# EAGLE design nw2s-b2dsp-panel (EAGLE 7.6.0)
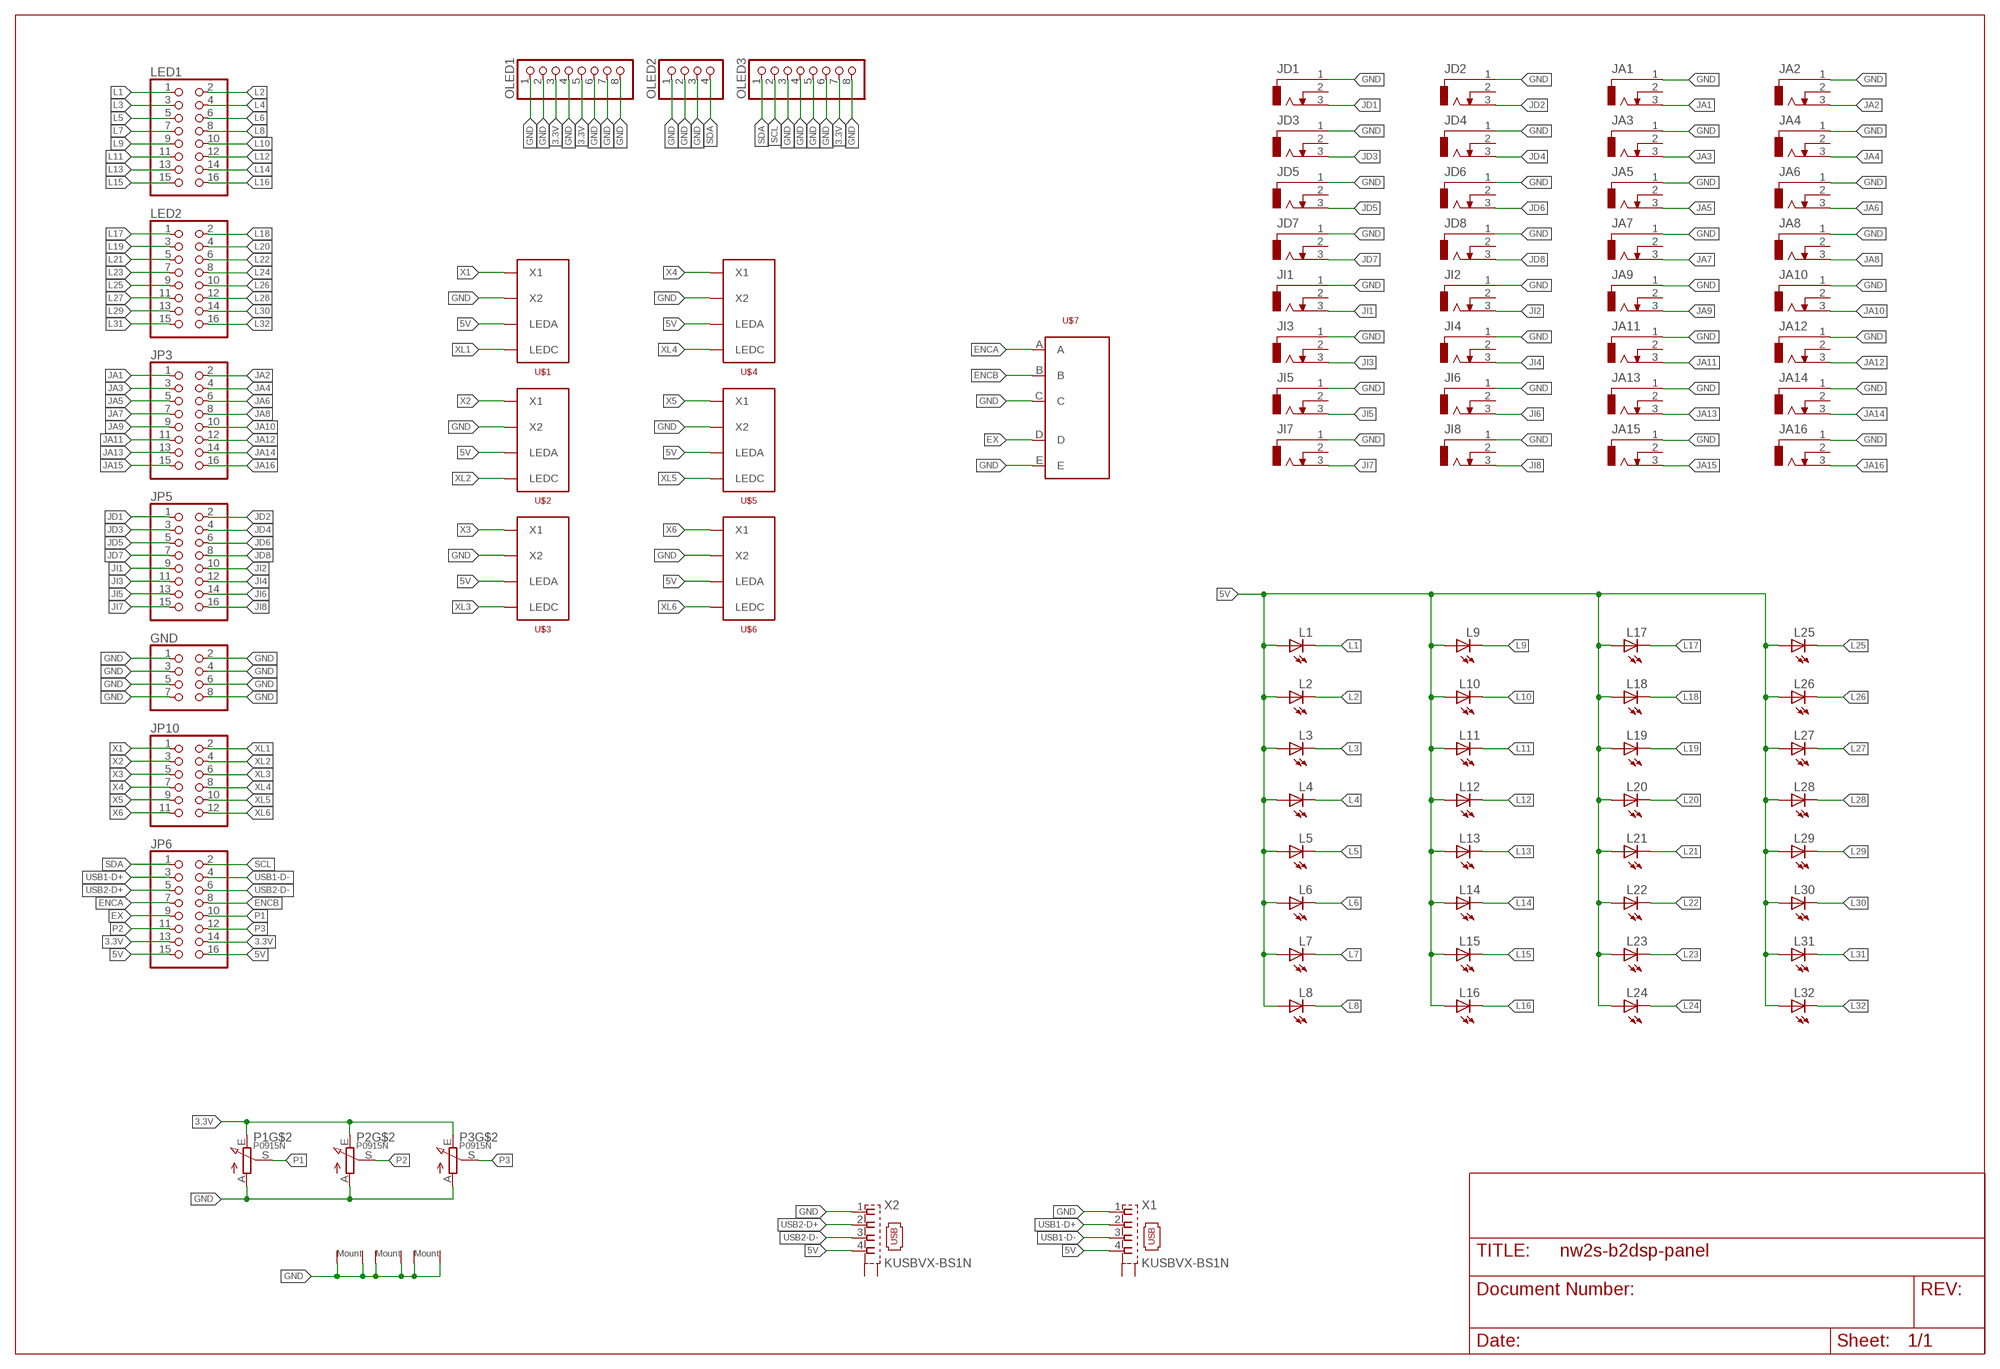
[diagram p0: schematic, sheet 1]

## Parts
GND  PINHD-2X4  [2X04]
JA1  THONK35A2  [THONK35A-2]
JA2  THONK35A2  [THONK35A-2]
JA3  THONK35A2  [THONK35A-2]
JA4  THONK35A2  [THONK35A-2]
JA5  THONK35A2  [THONK35A-2]
JA6  THONK35A2  [THONK35A-2]
JA7  THONK35A2  [THONK35A-2]
JA8  THONK35A2  [THONK35A-2]
JA9  THONK35A2  [THONK35A-2]
JA10  THONK35A2  [THONK35A-2]
JA11  THONK35A2  [THONK35A-2]
JA12  THONK35A2  [THONK35A-2]
JA13  THONK35A2  [THONK35A-2]
JA14  THONK35A2  [THONK35A-2]
JA15  THONK35A2  [THONK35A-2]
JA16  THONK35A2  [THONK35A-2]
JD1  THONK35A2  [THONK35A-2]
JD2  THONK35A2  [THONK35A-2]
JD3  THONK35A2  [THONK35A-2]
JD4  THONK35A2  [THONK35A-2]
JD5  THONK35A2  [THONK35A-2]
JD6  THONK35A2  [THONK35A-2]
JD7  THONK35A2  [THONK35A-2]
JD8  THONK35A2  [THONK35A-2]
JI1  THONK35A2  [THONK35A-2]
JI2  THONK35A2  [THONK35A-2]
JI3  THONK35A2  [THONK35A-2]
JI4  THONK35A2  [THONK35A-2]
JI5  THONK35A2  [THONK35A-2]
JI6  THONK35A2  [THONK35A-2]
JI7  THONK35A2  [THONK35A-2]
JI8  THONK35A2  [THONK35A-2]
JP3  PINHD-2X8  [2X08]
JP5  PINHD-2X8  [2X08]
JP6  PINHD-2X8  [2X08]
JP10  PINHD-2X6  [2X06]
L1  LED3MM  [LED3MM]
L2  LED3MM  [LED3MM]
L3  LED3MM  [LED3MM]
L4  LED3MM  [LED3MM]
L5  LED3MM  [LED3MM]
L6  LED3MM  [LED3MM]
L7  LED3MM  [LED3MM]
L8  LED3MM  [LED3MM]
L9  LED3MM  [LED3MM]
L10  LED3MM  [LED3MM]
L11  LED3MM  [LED3MM]
L12  LED3MM  [LED3MM]
L13  LED3MM  [LED3MM]
L14  LED3MM  [LED3MM]
L15  LED3MM  [LED3MM]
L16  LED3MM  [LED3MM]
L17  LED3MM  [LED3MM]
L18  LED3MM  [LED3MM]
L19  LED3MM  [LED3MM]
L20  LED3MM  [LED3MM]
L21  LED3MM  [LED3MM]
L22  LED3MM  [LED3MM]
L23  LED3MM  [LED3MM]
L24  LED3MM  [LED3MM]
L25  LED3MM  [LED3MM]
L26  LED3MM  [LED3MM]
L27  LED3MM  [LED3MM]
L28  LED3MM  [LED3MM]
L29  LED3MM  [LED3MM]
L30  LED3MM  [LED3MM]
L31  LED3MM  [LED3MM]
L32  LED3MM  [LED3MM]
LED1  PINHD-2X8  [2X08]
LED2  PINHD-2X8  [2X08]
OLED1  PINHD-1X8  [1X08]
OLED2  PINHD-1X4  [1X04]
OLED3  PINHD-1X8  [1X08]
P1  P0915N  [P0915N]
P2  P0915N  [P0915N]
P3  P0915N  [P0915N]
U$1  MEC5G  [MEC5G]
U$2  MEC5G  [MEC5G]
U$3  MEC5G  [MEC5G]
U$4  MEC5G  [MEC5G]
U$5  MEC5G  [MEC5G]
U$6  MEC5G  [MEC5G]
U$7  EN11X  [EN11]
X1  KUSBVX-BS1N  [KUSBVX-BS1N]
X2  KUSBVX-BS1N  [KUSBVX-BS1N]

## Nets
3.3V: JP6.13 JP6.14 OLED1.3 OLED1.5 OLED3.7 P1.E P2.E P3.E
5V: JP6.15 JP6.16 L1.A L2.A L3.A L4.A L5.A L6.A L7.A L8.A L9.A L10.A L11.A L12.A L13.A L14.A L15.A L16.A L17.A L18.A L19.A L20.A L21.A L22.A L23.A L24.A L25.A L26.A L27.A L28.A L29.A L30.A L31.A L32.A U$1.P$4(LEDA) U$2.P$4(LEDA) U$3.P$4(LEDA) U$4.P$4(LEDA) U$5.P$4(LEDA) U$6.P$4(LEDA) X1.4 X2.4
ENCA: JP6.7 U$7.A
ENCB: JP6.8 U$7.B
EX: JP6.9 U$7.D
GND: GND.1 GND.2 GND.3 GND.4 GND.5 GND.6 GND.7 GND.8 JA1.1 JA2.1 JA3.1 JA4.1 JA5.1 JA6.1 JA7.1 JA8.1 JA9.1 JA10.1 JA11.1 JA12.1 JA13.1 JA14.1 JA15.1 JA16.1 JD1.1 JD2.1 JD3.1 JD4.1 JD5.1 JD6.1 JD7.1 JD8.1 JI1.1 JI2.1 JI3.1 JI4.1 JI5.1 JI6.1 JI7.1 JI8.1 OLED1.1 OLED1.2 OLED1.4 OLED1.6 OLED1.7 OLED1.8 OLED2.1 OLED2.2 OLED2.3 OLED3.3 OLED3.4 OLED3.5 OLED3.6 OLED3.8 P1.A P1.GND@1(GND) P1.GND@2(GND) P2.A P2.GND@1(GND) P2.GND@2(GND) P3.A P3.GND@1(GND) P3.GND@2(GND) U$1.P$3(X2) U$2.P$3(X2) U$3.P$3(X2) U$4.P$3(X2) U$5.P$3(X2) U$6.P$3(X2) U$7.C U$7.E X1.1 X2.1
JA1: JA1.3 JP3.1
JA2: JA2.3 JP3.2
JA3: JA3.3 JP3.3
JA4: JA4.3 JP3.4
JA5: JA5.3 JP3.5
JA6: JA6.3 JP3.6
JA7: JA7.3 JP3.7
JA8: JA8.3 JP3.8
JA9: JA9.3 JP3.9
JA10: JA10.3 JP3.10
JA11: JA11.3 JP3.11
JA12: JA12.3 JP3.12
JA13: JA13.3 JP3.13
JA14: JA14.3 JP3.14
JA15: JA15.3 JP3.15
JA16: JA16.3 JP3.16
JD1: JD1.3 JP5.1
JD2: JD2.3 JP5.2
JD3: JD3.3 JP5.3
JD4: JD4.3 JP5.4
JD5: JD5.3 JP5.5
JD6: JD6.3 JP5.6
JD7: JD7.3 JP5.7
JD8: JD8.3 JP5.8
JI1: JI1.3 JP5.9
JI2: JI2.3 JP5.10
JI3: JI3.3 JP5.11
JI4: JI4.3 JP5.12
JI5: JI5.3 JP5.13
JI6: JI6.3 JP5.14
JI7: JI7.3 JP5.15
JI8: JI8.3 JP5.16
L1: L1.K(C) LED1.1
L2: L2.K(C) LED1.2
L3: L3.K(C) LED1.3
L4: L4.K(C) LED1.4
L5: L5.K(C) LED1.5
L6: L6.K(C) LED1.6
L7: L7.K(C) LED1.7
L8: L8.K(C) LED1.8
L9: L9.K(C) LED1.9
L10: L10.K(C) LED1.10
L11: L11.K(C) LED1.11
L12: L12.K(C) LED1.12
L13: L13.K(C) LED1.13
L14: L14.K(C) LED1.14
L15: L15.K(C) LED1.15
L16: L16.K(C) LED1.16
L17: L17.K(C) LED2.1
L18: L18.K(C) LED2.2
L19: L19.K(C) LED2.3
L20: L20.K(C) LED2.4
L21: L21.K(C) LED2.5
L22: L22.K(C) LED2.6
L23: L23.K(C) LED2.7
L24: L24.K(C) LED2.8
L25: L25.K(C) LED2.9
L26: L26.K(C) LED2.10
L27: L27.K(C) LED2.11
L28: L28.K(C) LED2.12
L29: L29.K(C) LED2.13
L30: L30.K(C) LED2.14
L31: L31.K(C) LED2.15
L32: L32.K(C) LED2.16
P1: JP6.10 P1.S
P2: JP6.11 P2.S
P3: JP6.12 P3.S
SCL: JP6.2 OLED3.2
SDA: JP6.1 OLED2.4 OLED3.1
USB1-D+: JP6.3 X1.2
USB1-D-: JP6.4 X1.3
USB2-D+: JP6.5 X2.2
USB2-D-: JP6.6 X2.3
X1: JP10.1 U$1.P$2(X1)
X2: JP10.3 U$2.P$2(X1)
X3: JP10.5 U$3.P$2(X1)
X4: JP10.7 U$4.P$2(X1)
X5: JP10.9 U$5.P$2(X1)
X6: JP10.11 U$6.P$2(X1)
XL1: JP10.2 U$1.P$1(LEDC)
XL2: JP10.4 U$2.P$1(LEDC)
XL3: JP10.6 U$3.P$1(LEDC)
XL4: JP10.8 U$4.P$1(LEDC)
XL5: JP10.10 U$5.P$1(LEDC)
XL6: JP10.12 U$6.P$1(LEDC)
Unconnected: JA1.2 JA2.2 JA3.2 JA4.2 JA5.2 JA6.2 JA7.2 JA8.2 JA9.2 JA10.2 JA11.2 JA12.2 JA13.2 JA14.2 JA15.2 JA16.2 JD1.2 JD2.2 JD3.2 JD4.2 JD5.2 JD6.2 JD7.2 JD8.2 JI1.2 JI2.2 JI3.2 JI4.2 JI5.2 JI6.2 JI7.2 JI8.2 X1.M1(S1) X1.M2(S2) X2.M1(S1) X2.M2(S2)

## Library data of the parts
GND = pinhead:PINHD-2X4: PIN HEADER
JA1-JA16 JD1-JD8 JI1-JI8 = nw2s:THONK35A: Thonkiconn 3.5mm Switching Jack by nw2s.net for thonk.co.uk
JP3 JP5 JP6 LED1 LED2 = pinhead:PINHD-2X8: PIN HEADER
JP10 = pinhead:PINHD-2X6: PIN HEADER
L1-L32 = nw2s:LED: LED OSRAM: - CHIPLED LG R971, LG N971, LY N971, LG Q971, LY Q971, LO R971, LY R971 LH N974, LH R974 LS Q976, LO Q976, LY Q976 LO Q996 - Hyper CHIPLED LW Q18S LB Q993, LB Q99A, LB R99A - SideLED LS A670, LO A670, LY A670, LG A670, LP A670 LB A673, LV A673, LT A673, LW A673 LH A674 LY A675 LS A676, LA A676, LO A676, LY A676, LW A676 LS A679, LY A679, LG A679 - Hyper Micro SIDELED® LS Y876, LA Y876, LO Y876, LY Y876 LT Y87S - SmartLED LW L88C, LW L88S LB L89C, LB L89S, LG L890 LS L89K, LO L89K, LY L89K LS L896, LA L896, LO L896, LY L896 - TOPLED LS T670, LO T670, LY T670, LG T670, LP T670 LSG T670, LSP T670, LSY T670, LOP T670, LYG T670 LG T671, LOG T671, LSG T671 LB T673, LV T673, LT T673, LW T673 LH T674 LS T676, LA T676, LO T676, LY T676, LB T676, LH T676, LSB T676, LW T676 LB T67C, LV T67C, LT T67C, LS T67K, LO T67K, LY T67K, LW E67C LS E67B, LA E67B, LO E67B, LY E67B, LB E67C, LV E67C, LT E67C LW T67C LS T679, LY T679, LG T679 LS T770, LO T770, LY T770, LG T770, LP T770 LB T773, LV T773, LT T773, LW T773 LH T774 LS E675, LA E675, LY E675, LS T675 LS T776, LA T776, LO T776, LY T776, LB T776 LHGB T686 LT T68C, LB T68C - Hyper Mini TOPLED® LB M676 - Mini TOPLED Santana® LG M470 LS M47K, LO M47K, LY M47K Source: http://www.osram.convergy.de LUXEON: - LUMILED® LXK2-PW12-R00, LXK2-PW12-S00, LXK2-PW14-U00, LXK2-PW14-V00 LXK2-PM12-R00, LXK2-PM12-S00, LXK2-PM14-U00 LXK2-PE12-Q00, LXK2-PE12-R00, LXK2-PE12-S00, LXK2-PE14-T00, LXK2-PE14-U00 LXK2-PB12-K00, LXK2-PB12-L00, LXK2-PB12-M00, LXK2-PB14-N00, LXK2-PB14-P00, LXK2-PB14-Q00 LXK2-PR12-L00, LXK2-PR12-M00, LXK2-PR14-Q00, LXK2-PR14-R00 LXK2-PD12-Q00, LXK2-PD12-R00, LXK2-PD12-S00 LXK2-PH12-R00, LXK2-PH12-S00 LXK2-PL12-P00, LXK2-PL12-Q00, LXK2-PL12-R00 Source: www.luxeon.com KINGBRIGHT: KA-3528ASYC Source: www.kingbright.com
OLED1 OLED3 = nw2s:PINHD-1X8: PIN HEADER
OLED2 = nw2s:PINHD-1X4: PIN HEADER
P1-P3 = pot-tt_electronics:P0915N
U$1-U$6 = nw2s:MEC5G
U$7 = nw2s:EN11X
X1 X2 = con-kycon:KUSBVX-BS1N: USB B-type Receptacle Vertical, 4 Position, Through Hole Source: Sibalco Kycon KUSBVX-BS1N-xxx.pdf

## Board
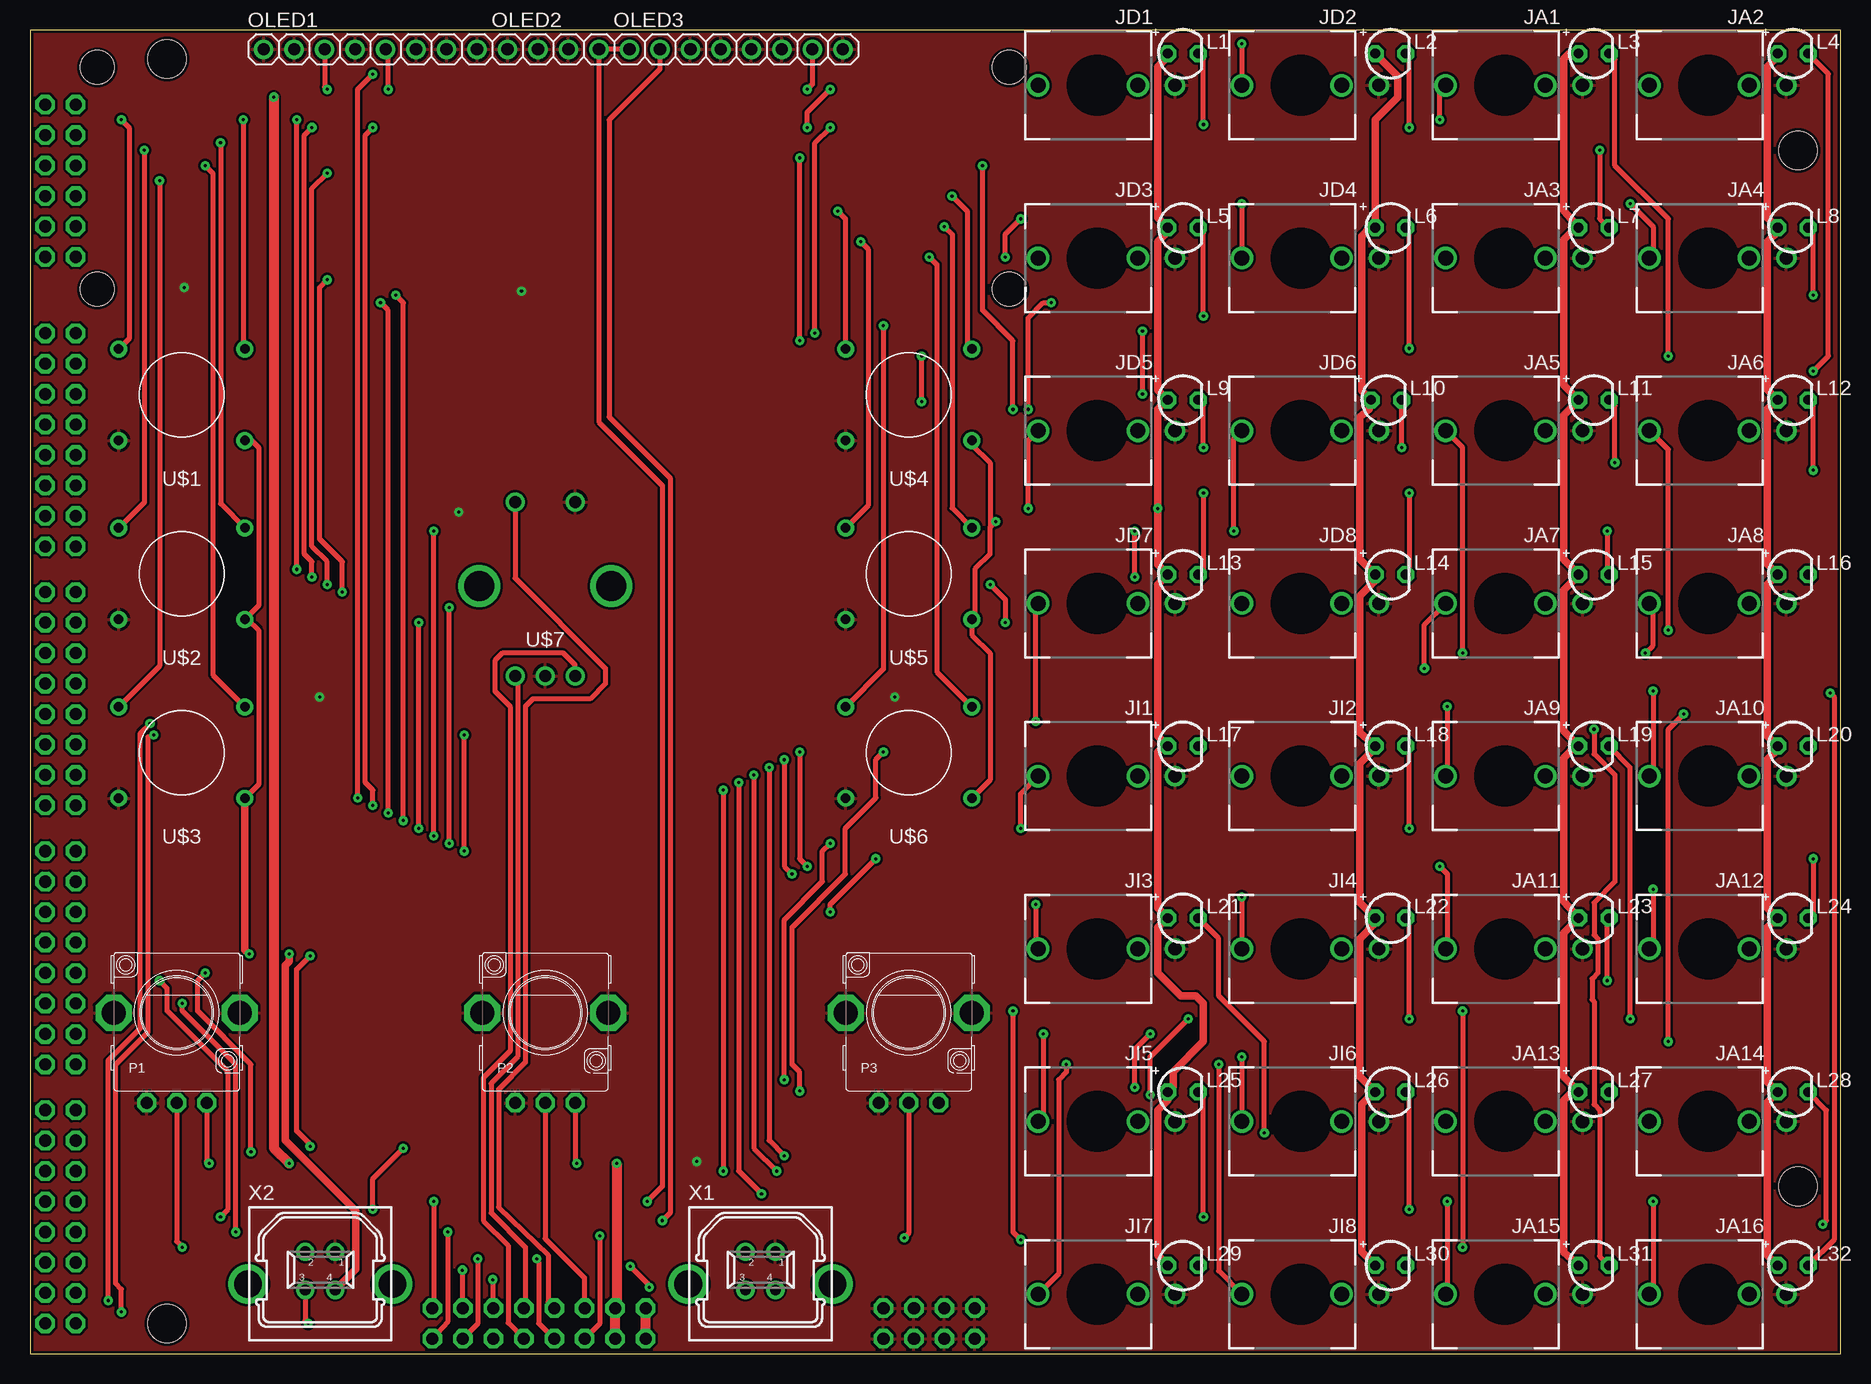
[diagram p1: board, top side]
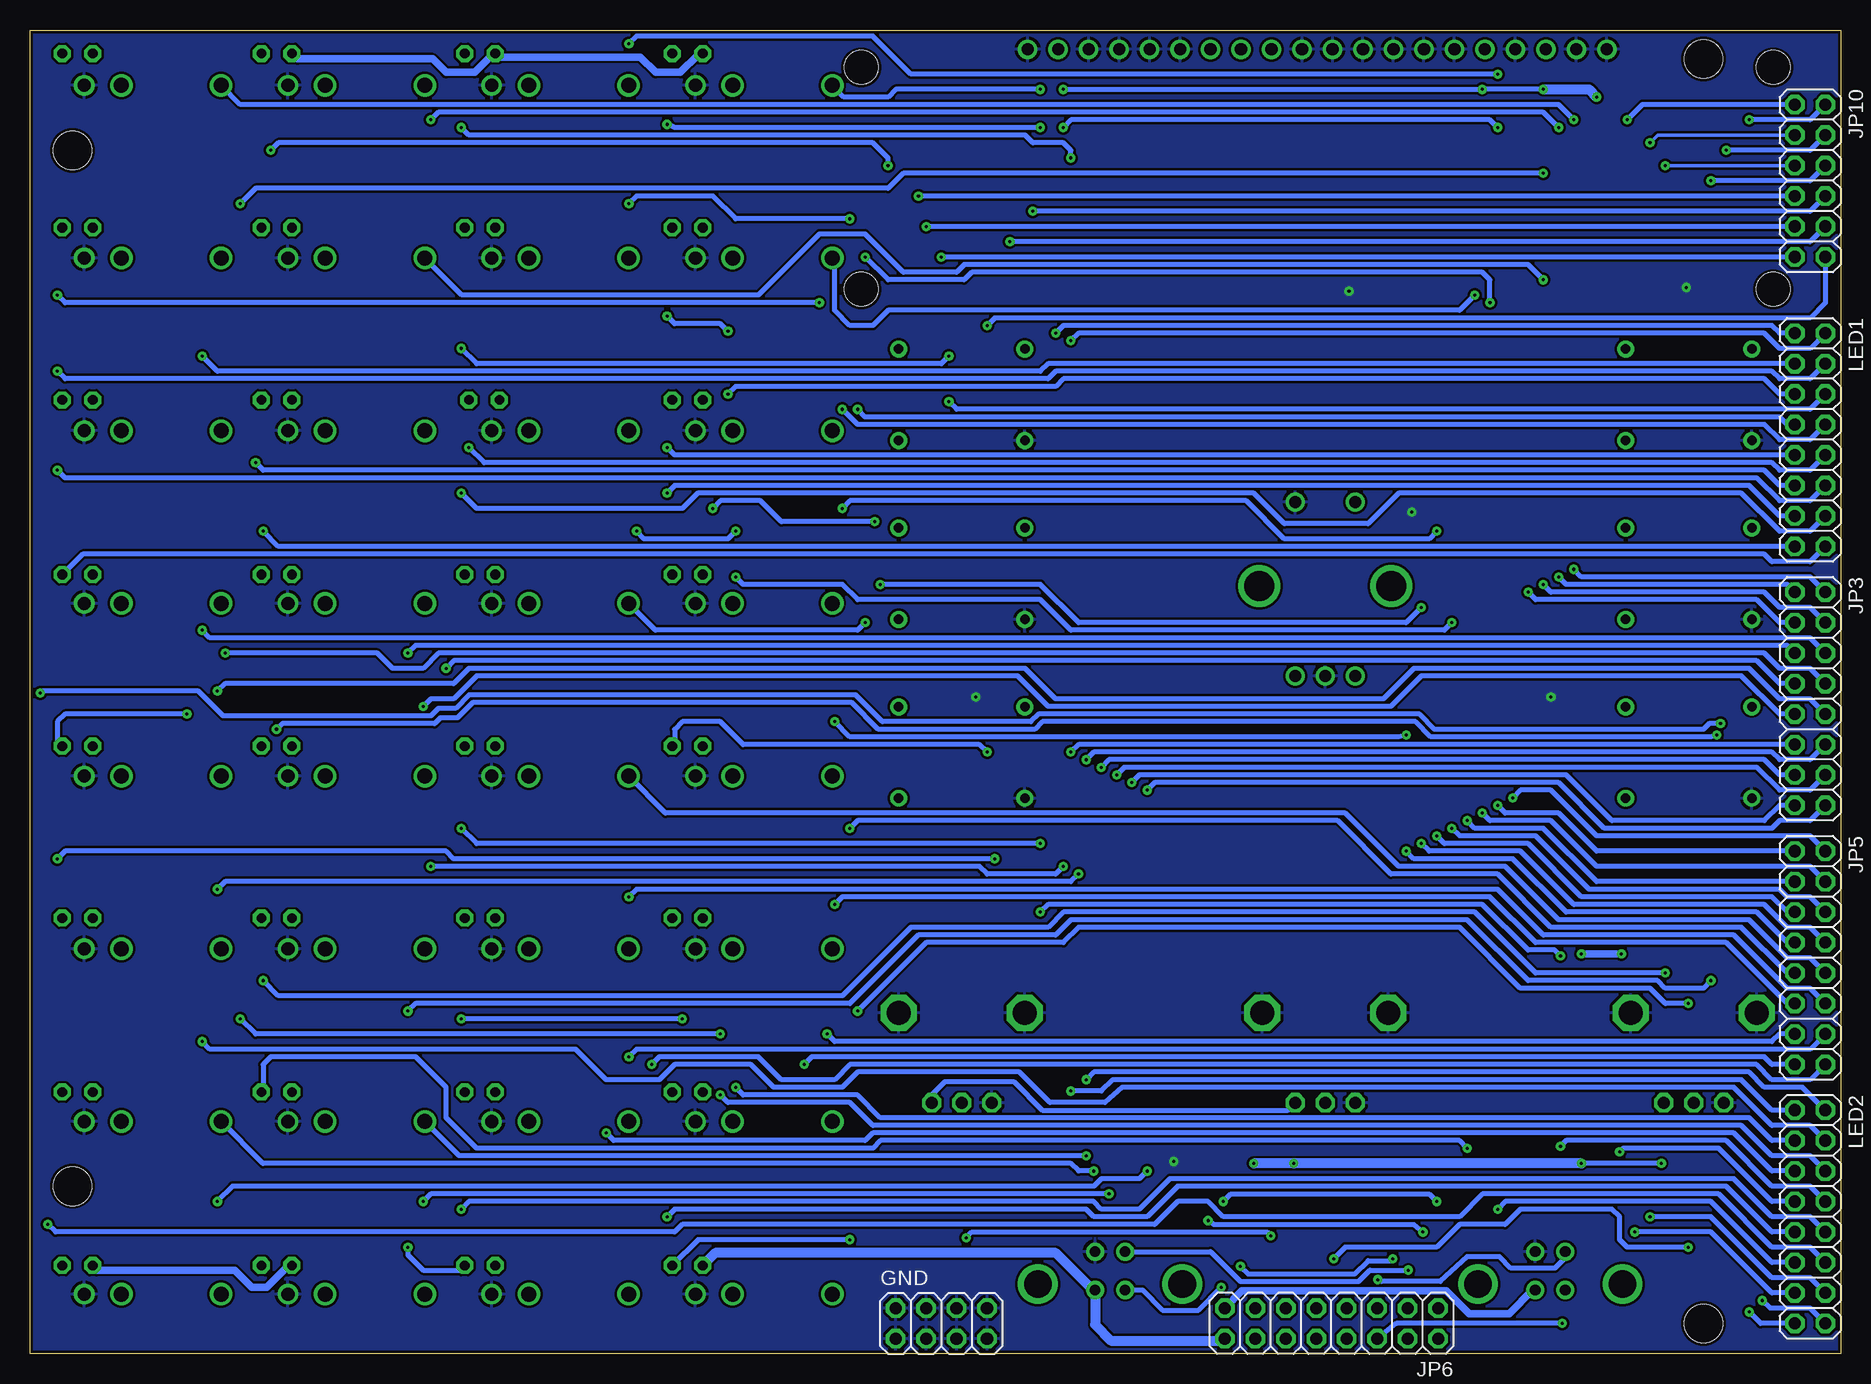
[diagram p2: board, bottom side, seen from below]

Size 150.88 x 110.36 mm. Coordinates in mm from the lower left corner, seen from the top.
Outline: 0,0 150.88,0 150.88,110.36 0,110.36 0,0
Copper layers (1*16): Top 0.035mm / dielectric 1.5mm / Bottom 0.035mm
Design rules "SparkFun *": minimum track width 8mil, minimum drill 10mil, track to track 8mil, track to pad 8mil, pad to pad 8mil, via to via 8mil, smd to smd 8mil, copper to edge 10mil, drill to drill 8mil, minimum pad ring 12mil, minimum via ring 10mil, stop-mask expansion 4mil, vias tented up to drill 25mil, thermal gap 10mil
Holes 2.8 mm at 5.6,107.25 5.6,88.75 81.6,107.25 81.6,88.75
Holes 3.2 mm at 11.43,107.95 11.43,2.54 147.32,13.97 147.32,100.33

### Footprints (pad centres in the part's own frame; a part is rotated, then mirrored left to right if it is on the bottom)
2X04 = drill 1.016 octagon: 1 -3.81,-1.27; 2 -3.81,1.27; 3 -1.27,-1.27; 4 -1.27,1.27; 5 1.27,-1.27; 6 1.27,1.27; 7 3.81,-1.27; 8 3.81,1.27
THONK35A-2 = drill 1.1 pad 1.5: 1 0,-6.48 | drill 1.25 pad 1.65: 2 0,-3.38; 3 0,4.92
2X08 = drill 1.016 octagon: 1 -8.89,-1.27; 2 -8.89,1.27; 3 -6.35,-1.27; 4 -6.35,1.27; 5 -3.81,-1.27; 6 -3.81,1.27; 7 -1.27,-1.27; 8 -1.27,1.27; 9 1.27,-1.27; 10 1.27,1.27; 11 3.81,-1.27; 12 3.81,1.27; 13 6.35,-1.27; 14 6.35,1.27; 15 8.89,-1.27; 16 8.89,1.27
2X06 = drill 1.016 octagon: 1 -6.35,-1.27; 2 -6.35,1.27; 3 -3.81,-1.27; 4 -3.81,1.27; 5 -1.27,-1.27; 6 -1.27,1.27; 7 1.27,-1.27; 8 1.27,1.27; 9 3.81,-1.27; 10 3.81,1.27; 11 6.35,-1.27; 12 6.35,1.27
LED3MM = drill 0.813 octagon: A -1.27,0; K 1.27,0
1X08 = drill 1.016: 1 -8.89,0; 2 -6.35,0; 3 -3.81,0; 4 -1.27,0; 5 1.27,0; 6 3.81,0; 7 6.35,0; 8 8.89,0
1X04 = drill 1.016: 1 -3.81,0; 2 -1.27,0; 3 1.27,0; 4 3.81,0
P0915N = drill 1 pad 1.6 octagon: A -2.5,-7.5; E 2.5,-7.5; S 0,-7.5 | drill 2 pad 3 octagon: GND@1 -5.25,0; GND@2 5.25,0
MEC5G = drill 0.8: P$1 -5.258,3.81; P$2 5.258,3.81; P$3 -5.258,-3.81; P$4 5.258,-3.81
EN11 = drill 1: A -2.5,-7.5; B 2.5,-7.5; C 0,-7.5; D -2.5,7; E 2.5,7 | drill 2.499: MNT1 5.5,0; MNT2 -5.5,0
KUSBVX-BS1N = drill 0.9 pad 1.422: 1 1.25,2.7; 2 -1.25,2.7; 3 -1.25,-0.5; 4 1.25,-0.5 | drill 2.3 pad 2.7: M1 -6.02,0; M2 6.02,0

### Placement (x,y rotation side)
GND  74.93,2.54 0 bottom
JA1  122.9,105.75 90 top
JA2  139.88,105.75 90 top
JA3  122.9,91.35 90 top
JA4  139.88,91.35 90 top
JA5  122.9,76.96 90 top
JA6  139.88,76.96 90 top
JA7  122.9,62.56 90 top
JA8  139.88,62.56 90 top
JA9  122.9,48.16 90 top
JA10  139.88,48.16 90 top
JA11  122.9,33.77 90 top
JA12  139.88,33.77 90 top
JA13  122.9,19.37 90 top
JA14  139.88,19.37 90 top
JA15  122.9,4.97 90 top
JA16  139.88,4.97 90 top
JD1  88.94,105.75 90 top
JD2  105.92,105.75 90 top
JD3  88.94,91.35 90 top
JD4  105.92,91.35 90 top
JD5  88.94,76.96 90 top
JD6  105.92,76.96 90 top
JD7  88.94,62.56 90 top
JD8  105.92,62.56 90 top
JI1  88.94,48.16 90 top
JI2  105.92,48.16 90 top
JI3  88.94,33.77 90 top
JI4  105.92,33.77 90 top
JI5  88.94,19.37 90 top
JI6  105.92,19.37 90 top
JI7  88.94,4.97 90 top
JI8  105.92,4.97 90 top
JP3  2.54,54.61 270 bottom
JP5  2.54,33.02 270 bottom
JP6  42.42,2.54 180 bottom
JP10  2.54,97.79 270 bottom
L1  96.08,108.39 0 top
L2  113.38,108.39 0 top
L3  130.32,108.39 0 top
L4  146.91,108.39 0 top
L5  96.08,93.87 0 top
L6  113.38,93.87 0 top
L7  130.32,93.87 0 top
L8  146.91,93.87 0 top
L9  96.08,79.52 0 top
L10  113.03,79.52 0 top
L11  130.32,79.52 0 top
L12  146.91,79.52 0 top
L13  96.08,64.96 0 top
L14  113.38,64.96 0 top
L15  130.32,64.96 0 top
L16  146.91,64.96 0 top
L17  96.08,50.66 0 top
L18  113.38,50.66 0 top
L19  130.32,50.66 0 top
L20  146.91,50.66 0 top
L21  96.08,36.32 0 top
L22  113.38,36.32 0 top
L23  130.32,36.32 0 top
L24  146.91,36.32 0 top
L25  96.08,21.83 0 top
L26  113.38,21.83 0 top
L27  130.32,21.83 0 top
L28  146.91,21.83 0 top
L29  96.08,7.37 0 top
L30  113.38,7.37 0 top
L31  130.32,7.37 0 top
L32  146.91,7.37 0 top
LED1  2.54,76.2 270 bottom
LED2  2.54,11.43 270 bottom
OLED1  28.36,108.75 0 top
OLED2  43.6,108.75 0 top
OLED3  58.84,108.75 0 top
P1  12.23,28.44 0 top
P2  42.94,28.44 0 top
P3  73.23,28.44 0 top
U$1  12.65,79.96 0 top
U$2  12.65,65.04 0 top
U$3  12.65,50.13 0 top
U$4  73.23,79.96 0 top
U$5  73.23,65.04 0 top
U$6  73.23,50.13 0 top
U$7  42.94,64.02 0 top
X1  60.87,5.82 0 top
X2  24.18,5.82 0 top

### Tracks (layer width: path | path; a pad name or v marks a point on that pad's centre or on a via)
3.3V  (via drill 0.25)
  Top 0.406: OLED1.3 24.55,105.62 v24.77,105.41 | v29.84,105.41 29.84,108.54 OLED1.5 | OLED3.7 65.19,105.83 v64.77,105.41 | P2.E 45.44,16 v45.56,15.88 | P1.E 14.72,16.07 v14.92,15.88
  Top 0.813: v20.32,104.78 20.32,17.14 v21.59,15.88 | v48.9,15.88 48.9,3.94 JP6.13 JP6.14
  Bottom 0.406: v24.77,105.41 v29.84,105.41 v64.77,105.41 | P3.E 75.73,21.59 74.61,22.7 68.9,22.7 66.52,20.32 46.05,20.32 P2.E | v14.92,15.88 v21.59,15.88
  Bottom 0.813: v24.77,105.41 20.95,105.41 v20.32,104.78 | v21.59,15.88 v45.56,15.88 v48.9,15.88
5V  (via drill 0.25)
  Top 0.406: U$1.P$4 18.47,76.15 19.05,75.56 19.05,62.38 U$2.P$4 18.14,61.23 19.05,60.33 19.05,47.47 U$3.P$4 | L8.A 145.64,93.57 | L12.A 145.56,79.53 | L16.A 145.61,64.96 | L20.A 145.64,50.39 | L24.A 145.54,36.33 | L28.A 145.64,21.82 | L7.A 128.8,93.87 | L11.A | L15.A 129.05,64.91 | L19.A 128.76,50.66 | L23.A 129.03,36.33 | L27.A 128.51,21.83 | U$4.P$4 78.49,75.82 80.01,74.3 80.01,68.9 | U$6.P$4 80.01,47.84 80.01,58.42 78.49,59.94 U$5.P$4 78.74,61.49 78.74,65.41 80.01,66.67 80.01,68.9 | L18.A 112.11,50.52 | L26.A 112,21.83 | L6.A 111.65,93.87 | L5.A 94.81,93.54 | L9.A 94.77,79.53 | L13.A | L17.A 94.47,50.66 | L21.A 94.75,36.33 | 80.01,68.9 v80.49,69.37
  Top 0.61: L4.A 145.64,108.18 144.78,107.31 144.78,94.73 L8.A | 145.64,93.57 144.78,92.71 144.78,80.39 L12.A | 145.56,79.53 144.78,78.74 144.78,65.82 L16.A | 145.61,64.96 144.78,64.14 144.78,51.52 L20.A | 145.64,50.39 144.78,49.53 144.78,37.19 L24.A | 145.54,36.33 144.78,35.56 144.78,22.69 L28.A | 145.64,21.82 144.78,20.95 144.78,8.23 L32.A | L3.A 128.24,108.39 127.79,107.95 127.79,95.29 L7.A | 128.8,93.87 127.79,92.87 127.79,80.78 L11.A | L11.A 127.79,78.26 127.79,66.21 L15.A | 129.05,64.91 127.79,63.66 127.79,51.91 L19.A | 128.76,50.66 127.79,49.69 127.79,37.74 L23.A | 129.03,36.33 127.79,35.08 127.79,23.09 L27.A | 128.51,21.83 127.79,21.11 127.79,8.46 L31.A | L18.A 110.81,51.8 110.81,63.18 112.11,64.49 L14.A 110.81,66.26 110.81,78.11 111.6,78.74 L10.A 110.97,80.32 110.97,93.19 111.65,93.87 | 112.11,50.52 110.81,49.21 110.81,37.63 L22.A 112.11,35.91 110.81,34.61 110.81,23.13 L26.A | 112,21.83 110.97,20.8 110.97,8.51 L30.A | L1.A 94.81,108.15 93.98,107.31 93.98,94.71 L5.A | 94.81,93.54 93.98,92.71 93.98,80.36 L9.A | 94.77,79.53 93.98,78.74 v93.98,70.48 93.98,65.79 L13.A | L13.A 93.98,64.14 93.98,51.49 L17.A | 94.47,50.66 93.98,50.16 93.98,37.16 L21.A | 94.75,36.33 93.98,35.56 93.98,31.75 95.89,29.84 97.16,29.84 97.79,29.21 97.79,26.04 95.25,23.5 95.25,22.27 L25.A 94.81,21.15 93.98,20.32 93.98,8.2 L29.A | U$3.P$4 17.9,33.69 v18.26,33.34 | v21.59,33.34 21.59,32.7 21.27,32.38 21.27,17.78 27.15,11.91 27.15,7.04 X2.4 | L6.A 112.11,102.9 113.98,104.78 113.98,106.52 L2.A
  Top 0.813: JP6.16 JP6.15
  Bottom 0.406: X2.4 25.63,5.32 | v80.49,69.37 88.27,69.37 90.01,71.12 93.34,71.12 v93.98,70.48 | 95.25,108.27 94.94,108.27 L1.A
  Bottom 0.61: 25.63,5.32 27.62,3.33 30.96,3.33 32.86,5.24 49.88,5.24 JP6.15 | v18.26,33.34 v21.59,33.34 | L3.A 128.6,107.95 117.32,107.95 116.2,106.84 113.82,106.84 112.27,108.39 L2.A 111.83,108.11 100.01,108.11 98.74,106.84 96.68,106.84 95.25,108.27 | L31.A 129.31,7.37 131.13,5.56 132.4,5.56 133.83,6.99 145.26,6.99 L32.A
  Bottom 0.813: JP6.16 51.47,1.11 60.8,1.11 62.12,2.43 X1.4 62.31,5.32 65.41,8.41 93.77,8.41 L29.A
ENCA
  Top 0.406: U$7.A 40.44,56.08 40.64,55.88 40.64,24.77 38.42,22.54 38.42,11.75 41.27,8.89 41.27,3.94 JP6.7
ENCB
  Top 0.406: U$7.B 45.44,57.43 44.45,58.42 39.37,58.42 38.73,57.78 38.73,55.24 40.01,53.98 40.01,25.24 37.78,23.02 37.78,11.11 39.85,9.05 39.85,2.57 JP6.8
EX
  Top 0.406: U$7.D 40.44,64.66 47.94,57.15 47.94,55.88 46.67,54.61 41.91,54.61 41.27,53.98 41.27,24.29 39.05,22.07 39.05,12.22 43.18,8.26 43.18,4.32 JP6.9
GND  (via drill 0.25)
  other vias: 35.72,70.17 24.13,54.77 55.56,16.03 72.07,54.77 40.96,88.58 12.86,88.9
  pour Bottom: 0,110.49 151.13,110.49 151.13,0 0,0
  pour Top: -0.64,111.12 151.76,111.12 151.76,-0.64 -0.64,-0.64
JA1  (via drill 0.25)
  Top 0.406: v23.5,64.77 23.5,66.04 22.86,66.67 22.86,101.6 v23.5,102.23 | v117.47,102.87 117.47,105.25 JA1.3
  Bottom 0.406: JP3.1 4.45,64.14 22.86,64.14 v23.5,64.77 | v23.5,102.23 24.77,103.5 116.84,103.5 v117.47,102.87
JA2  (via drill 0.25)
  Top 0.406: v22.23,65.41 v22.23,102.87
  Bottom 0.406: JP3.2 2.54,64.77 21.59,64.77 v22.23,65.41 | v22.23,102.87 23.5,104.14 133.34,104.14 JA2.3
JA3  (via drill 0.25)
  Top 0.406: v26.04,63.5 26.04,66.04 24.13,67.94 24.13,88.9 v24.77,89.53
  Bottom 0.406: JP3.3 5.08,60.96 6.99,62.87 25.4,62.87 v26.04,63.5 | v24.77,89.53 26.04,90.81 73.03,90.81 73.66,90.17 78.11,90.17 81.28,93.34 85.09,93.34 90.17,88.27 114.89,88.27 JA3.3
JA4  (via drill 0.25)
  Top 0.406: v24.77,64.14 24.77,66.04 23.5,67.31 23.5,97.16 v24.77,98.42 | v133.35,95.89 135.25,93.98 135.25,91.65 JA4.3
  Bottom 0.406: JP3.4 2.54,62.23 5.08,62.23 6.35,63.5 24.13,63.5 v24.77,64.14 | v24.77,98.42 78.11,98.42 79.38,97.16 132.08,97.16 v133.35,95.89
JA5  (via drill 0.25)
  Top 0.406: v119.38,58.42 119.38,75.56 JA5.3
  Bottom 0.406: JP3.5 4.45,59.05 118.75,59.05 v119.38,58.42
JA6  (via drill 0.25)
  Top 0.406: v136.53,60.33 136.53,75.39 JA6.3
  Bottom 0.406: JP3.6 2.54,59.69 135.89,59.69 v136.53,60.33
JA7  (via drill 0.25)
  Top 0.406: v116.2,57.15 116.2,60.79 JA7.3
  Bottom 0.406: JP3.7 5.08,55.88 6.99,57.78 115.57,57.78 v116.2,57.15
JA8  (via drill 0.25)
  Top 0.406: v134.62,58.42 135.25,59.05 135.25,62.26 JA8.3
  Bottom 0.406: JP3.8 2.54,57.15 5.08,57.15 6.35,58.42 116.84,58.42 118.11,57.15 120.65,57.15 121.92,58.42 v134.62,58.42
JA9  (via drill 0.25)
  Top 0.406: v118.11,53.98 118.11,48.3 JA9.3
  Bottom 0.406: JP3.9 5.08,53.34 8.26,56.52 34.92,56.52 37.47,53.98 66.04,53.98 68.58,56.52 113.67,56.52 115.57,54.61 117.47,54.61 v118.11,53.98
JA10  (via drill 0.25)
  Top 0.406: v135.25,55.24 135.25,48.46 JA10.3
  Bottom 0.406: JP3.10 2.54,54.61 5.08,54.61 7.62,57.15 35.56,57.15 38.1,54.61 65.41,54.61 67.94,57.15 114.3,57.15 115.57,55.88 134.62,55.88 v135.25,55.24
JA11  (via drill 0.25)
  Top 0.406: v64.14,50.16 64.14,41.27 v64.77,40.64 | v117.47,40.64 118.11,40.01 118.11,33.9 JA11.3
  Bottom 0.406: JP3.11 63.5,50.8 v64.14,50.16 | v64.77,40.64 65.41,40.01 71.12,40.01 71.75,40.64 v117.47,40.64
JA12  (via drill 0.25)
  Top 0.406: v62.87,49.53 62.87,40.64 v63.5,40.01 | v135.25,38.73 135.25,34.07 JA12.3
  Bottom 0.406: JP3.12 2.54,49.53 5.08,49.53 5.71,50.16 62.23,50.16 v62.87,49.53 | v63.5,40.01 64.14,39.37 134.62,39.37 v135.25,38.73
JA13  (via drill 0.25)
  Top 0.406: v61.59,48.9 61.59,17.78 v62.87,16.51
  Bottom 0.406: JP3.13 5.08,48.26 6.35,49.53 60.96,49.53 v61.59,48.9 | v62.87,16.51 115.12,16.51 JA13.3
JA14  (via drill 0.25)
  Top 0.406: v60.33,48.26 60.33,17.14 v62.23,15.24
  Bottom 0.406: JP3.14 2.54,46.99 5.08,46.99 6.99,48.9 59.69,48.9 v60.33,48.26 | v62.23,15.24 63.5,15.24 64.14,15.88 131.46,15.88 JA14.3
JA15  (via drill 0.25)
  Top 0.406: v59.05,47.62 59.05,15.24 v60.96,13.34 | v118.11,12.7 118.11,5.11 JA15.3
  Bottom 0.406: JP3.15 5.08,45.72 6.35,44.45 19.05,44.45 22.86,48.26 58.42,48.26 v59.05,47.62 | v60.96,13.34 117.47,13.34 v118.11,12.7
JA16  (via drill 0.25)
  Top 0.406: v57.78,46.99 v57.78,15.24 | v135.25,12.7 135.25,5.27 JA16.3
  Bottom 0.406: JP3.16 2.54,44.45 5.08,44.45 5.71,43.81 19.68,43.81 23.5,47.62 57.15,47.62 v57.78,46.99 | v57.78,15.24 58.42,14.61 61.59,14.61 62.23,13.97 133.99,13.97 v135.25,12.7
JD1  (via drill 0.25)
  Top 0.406: v28.57,45.72 28.57,46.99 27.94,47.62 27.94,101.6 v28.57,102.23 | v64.77,102.23 64.77,103.5 v66.67,105.41
  Bottom 0.406: JP5.1 20.32,41.91 23.5,45.09 27.94,45.09 v28.57,45.72 | v28.57,102.23 29.21,102.87 64.14,102.87 v64.77,102.23 | v66.67,105.41 78.74,105.41 79.38,104.78 83.05,104.78 JD1.3
JD2  (via drill 0.25)
  Top 0.406: v27.3,46.35 27.3,105.41 v28.57,106.68 | v100.97,109.22 100.97,105.78 JD2.3
  Bottom 0.406: JP5.2 2.54,43.18 20.32,43.18 24.13,46.99 26.67,46.99 v27.3,46.35 | v28.57,106.68 77.47,106.68 80.64,109.86 100.33,109.86 v100.97,109.22
JD3  (via drill 0.25)
  Top 0.406: v31.11,44.45 31.11,87.63 v30.48,88.27
  Bottom 0.406: JP5.3 20.32,39.37 24.77,43.81 30.48,43.81 v31.11,44.45 | v30.48,88.27 31.75,87 79.38,87 80.64,85.72 82.55,85.72 83.82,87 83.82,91.15 JD3.3
JD4  (via drill 0.25)
  Top 0.406: v29.84,45.09 29.84,87 v29.21,87.63 | v81.28,91.44 81.28,93.34 v82.55,94.61 | v100.97,95.89 100.97,91.39 JD4.3
  Bottom 0.406: JP5.4 2.54,40.64 20.32,40.64 24.13,44.45 29.21,44.45 v29.84,45.09 | v29.21,87.63 29.21,89.53 29.84,90.17 72.39,90.17 73.03,89.53 79.38,89.53 v81.28,91.44 | v82.55,94.61 92.08,94.61 93.98,96.52 100.33,96.52 v100.97,95.89
JD5  (via drill 0.25)
  Top 0.406: v33.66,43.18 v33.66,68.58 | v83.19,70.48 83.19,76.12 JD5.3
  Bottom 0.406: JP5.5 4.45,36.83 5.71,38.1 21.59,38.1 26.04,42.55 33.02,42.55 v33.66,43.18 | v33.66,68.58 34.29,67.94 46.35,67.94 49.53,71.12 82.55,71.12 v83.19,70.48
JD6  (via drill 0.25)
  Top 0.406: v32.38,43.81 v32.38,60.96 | v92.08,64.77 v92.08,68.58 | v100.33,68.58 100.33,76.29 JD6.3
  Bottom 0.406: JP5.6 2.54,38.1 4.45,38.1 5.08,38.73 20.95,38.73 25.4,43.18 31.75,43.18 v32.38,43.81 | v32.38,60.96 33.02,60.33 64.14,60.33 66.67,62.87 81.92,62.87 83.19,64.14 91.44,64.14 v92.08,64.77 | v92.08,68.58 92.71,67.94 99.69,67.94 v100.33,68.58
JD7  (via drill 0.25)
  Top 0.406: v36.2,41.91 v36.2,51.59 | v83.82,52.7 83.82,62.36 JD7.3
  Bottom 0.406: JP5.7 4.45,34.29 6.99,36.83 22.86,36.83 27.3,41.27 35.56,41.27 v36.2,41.91 | v36.2,51.59 36.83,51.44 82.55,51.44 v83.82,52.7
JD8  (via drill 0.25)
  Top 0.406: v34.92,42.55 v34.92,62.23 | v80.01,64.14 81.28,62.87 v81.28,60.96
  Bottom 0.406: JP5.8 2.54,35.56 4.45,35.56 6.35,37.47 22.23,37.47 26.67,41.91 34.29,41.91 v34.92,42.55 | v34.92,62.23 36.2,60.96 63.5,60.96 66.67,64.14 v80.01,64.14 | v81.28,60.96 81.92,60.33 98.76,60.33 JD8.3
JI1  (via drill 0.25)
  Top 0.406: v82.55,43.81 82.55,46.69 JI1.3
  Bottom 0.406: JP5.9 4.45,31.75 8.26,35.56 24.13,35.56 28.57,40.01 37.47,40.01 41.91,44.45 81.92,44.45 v82.55,43.81
JI2
  Bottom 0.406: JP5.10 2.54,33.02 4.45,33.02 7.62,36.2 23.5,36.2 27.94,40.64 36.83,40.64 41.27,45.09 97.92,45.09 JI2.3
JI3  (via drill 0.25)
  Top 0.406: v83.82,37.47 83.82,33.97 JI3.3
  Bottom 0.406: JP5.11 4.45,29.21 9.53,34.29 25.4,34.29 29.21,38.1 83.19,38.1 v83.82,37.47
JI4  (via drill 0.25)
  Top 0.406: v100.97,38.1 100.97,33.8 JI4.3
  Bottom 0.406: JP5.12 2.54,30.48 4.45,30.48 8.89,34.92 24.77,34.92 28.57,38.73 100.33,38.73 v100.97,38.1
JI5  (via drill 0.25)
  Top 0.406: v84.45,26.67 84.45,19.8 JI5.3
  Bottom 0.406: JP5.13 5.08,26.67 5.71,26.04 83.82,26.04 v84.45,26.67
JI6  (via drill 0.25)
  Top 0.406: v100.97,24.77 100.97,19.4 JI6.3
  Bottom 0.406: JP5.14 2.54,25.4 100.33,25.4 v100.97,24.77
JI7  (via drill 0.25)
  Top 0.406: v86.36,24.13 86.36,23.5 85.72,22.86 85.72,6.68 JI7.3
  Bottom 0.406: JP5.15 5.71,24.13 6.35,24.77 85.72,24.77 v86.36,24.13
JI8  (via drill 0.25)
  Top 0.406: v99.06,24.13 99.06,6.91 JI8.3
  Bottom 0.406: JP5.16 2.54,22.86 5.71,22.86 6.99,24.13 82.55,24.13 83.82,22.86 88.27,22.86 90.17,24.77 98.42,24.77 v99.06,24.13
L1  (via drill 0.25)
  Top 0.406: v65.41,85.09 65.41,100.97 v66.67,102.23 | v97.79,102.49 97.79,107.96 L1.K
  Bottom 0.406: LED1.1 5.08,85.09 5.71,85.72 64.77,85.72 v65.41,85.09 | v66.67,102.23 97.16,102.23 v97.79,102.49
L2  (via drill 0.25)
  Top 0.406: v64.14,84.45 v64.14,99.69 | v114.94,102.23 114.94,108.11 L2.K
  Bottom 0.406: LED1.2 2.54,83.82 5.08,83.82 6.35,85.09 63.5,85.09 v64.14,84.45 | v64.14,99.69 64.14,100.33 64.77,100.97 67.31,100.97 67.94,101.6 114.3,101.6 v114.94,102.23
L3  (via drill 0.25)
  Top 0.406: v136.53,83.19 136.53,94.61 132.08,99.06 132.08,107.9 L3.K
  Bottom 0.406: LED1.3 66.04,82.55 66.67,81.92 135.25,81.92 v136.53,83.19
L4  (via drill 0.25)
  Top 0.406: v148.59,81.92 149.86,83.19 149.86,106.72 L4.K
  Bottom 0.406: LED1.4 2.54,81.28 5.08,81.28 5.71,81.92 65.41,81.92 66.04,81.28 147.96,81.28 v148.59,81.92
L5  (via drill 0.25)
  Top 0.406: v92.71,80.01 v92.71,85.25 | v97.79,86.52 97.79,93.44 L5.K
  Bottom 0.406: LED1.5 5.08,80.01 6.35,81.28 64.77,81.28 65.41,80.64 92.08,80.64 v92.71,80.01 | v92.71,85.25 93.34,85.88 97.16,85.88 v97.79,86.52
L6  (via drill 0.25)
  Top 0.406: v74.3,79.38 v74.3,83.19 | v114.94,83.82 114.94,93.59 L6.K
  Bottom 0.406: LED1.6 2.54,78.74 73.66,78.74 v74.3,79.38 | v74.3,83.19 74.93,82.55 113.67,82.55 v114.94,83.82
L7  (via drill 0.25)
  Top 0.406: v81.92,78.74 81.92,84.45 79.38,87 v79.38,99.06 | v130.81,100.33 130.81,94.65 L7.K
  Bottom 0.406: LED1.7 4.45,77.47 5.08,78.11 81.28,78.11 v81.92,78.74 | v79.38,99.06 79.38,99.69 80.64,100.97 130.18,100.97 v130.81,100.33
L8  (via drill 0.25)
  Top 0.406: v83.19,78.74 83.19,86.36 84.45,87.63 v85.09,87.63 | v148.59,88.27 148.59,93.46 L8.K
  Bottom 0.406: LED1.8 2.54,76.2 5.08,76.2 6.35,77.47 81.92,77.47 v83.19,78.74 | v85.09,87.63 147.96,87.63 v148.59,88.27
L9  (via drill 0.25)
  Top 0.406: v97.79,75.56 97.79,79.09 L9.K
  Bottom 0.406: LED1.9 97.16,74.93 v97.79,75.56
L10  (via drill 0.25)
  Top 0.406: v114.3,75.56 L10.K
  Bottom 0.406: LED1.10 2.54,73.66 5.08,73.66 5.71,74.3 113.03,74.3 v114.3,75.56
L11  (via drill 0.25)
  Top 0.406: v132.08,74.3 132.08,79.03 L11.K
  Bottom 0.406: LED1.11 5.08,72.39 6.35,73.66 131.44,73.66 v132.08,74.3
L12  (via drill 0.25)
  Top 0.406: v148.59,73.66 148.59,79.12 L12.K
  Bottom 0.406: LED1.12 2.54,71.12 5.08,71.12 6.99,73.03 147.96,73.03 v148.59,73.66
L13  (via drill 0.25)
  Top 0.406: v97.79,71.75 97.79,65.4 L13.K
  Bottom 0.406: LED1.13 5.08,69.85 7.62,72.39 97.16,72.39 v97.79,71.75
L14  (via drill 0.25)
  Top 0.406: v114.94,71.75 114.94,65.25 L14.K
  Bottom 0.406: LED1.14 2.54,68.58 5.08,68.58 8.26,71.75 36.83,71.75 39.37,69.22 46.35,69.22 48.9,71.75 95.25,71.75 96.52,70.48 113.67,70.48 v114.94,71.75
L15  (via drill 0.25)
  Top 0.406: v131.44,68.58 131.44,65.1 L15.K
  Bottom 0.406: LED1.15 130.18,67.31 v131.44,68.58
L16
  Bottom 0.406: LED1.16 2.54,66.04 5.71,66.04 6.35,66.67 146.47,66.67 L16.K
L17  (via drill 0.25)
  Top 0.406: v64.14,21.91 64.14,23.5 63.5,24.13 63.5,35.56 67.94,40.01 67.94,43.81 70.48,46.35 70.48,49.53 v71.12,50.16
  Bottom 0.406: LED2.1 5.71,20.32 8.26,22.86 60.64,22.86 61.59,21.91 v64.14,21.91 | v71.12,50.16 71.75,50.8 91.44,50.8 93.34,52.7 96.52,52.7 97.16,52.07 97.16,50.86 L17.K
L18  (via drill 0.25)
  Top 0.406: v62.87,22.86 62.87,36.2 66.04,39.37 66.04,41.91 v66.67,42.55 | v114.94,43.81 114.94,50.37 L18.K
  Bottom 0.406: LED2.2 3.17,22.23 6.35,22.23 7.62,23.5 62.23,23.5 v62.87,22.86 | v66.67,42.55 113.67,42.55 v114.94,43.81
L19  (via drill 0.25)
  Top 0.406: v92.08,22.23 92.08,25.4 v93.34,26.67 | v133.35,27.94 133.35,48.9 L19.K
  Bottom 0.406: LED2.3 5.71,17.78 7.62,19.68 80.01,19.68 81.92,21.59 91.44,21.59 v92.08,22.23 | v93.34,26.67 132.08,26.67 v133.35,27.94
L20  (via drill 0.25)
  Top 0.406: v136.53,26.04 136.53,52.07 v137.79,53.34
  Bottom 0.406: LED2.4 2.54,19.05 5.71,19.05 8.89,22.23 59.85,22.23 61.28,20.95 65.88,20.95 68.42,23.5 81.92,23.5 83.19,22.23 88.9,22.23 90.81,24.13 97.16,24.13 98.42,22.86 102.87,22.86 105.41,25.4 135.89,25.4 v136.53,26.04 | v137.79,53.34 147.96,53.34 148.59,52.7 148.59,51.07 L20.K
L21  (via drill 0.25)
  Top 0.406: v102.87,18.41 102.87,26.04 99.06,29.84 99.06,34.62 L21.K
  Bottom 0.406: LED2.5 5.71,15.24 8.89,18.41 80.64,18.41 81.28,17.78 102.23,17.78 v102.87,18.41
L22  (via drill 0.25)
  Top 0.406: v93.34,21.59 93.34,24.77 v96.52,27.94 | v114.94,27.94 114.94,36.04 L22.K
  Bottom 0.406: LED2.6 2.54,16.51 5.71,16.51 8.26,19.05 80.64,19.05 82.55,20.95 92.71,20.95 v93.34,21.59 | v96.52,27.94 v114.94,27.94
L23  (via drill 0.25)
  Top 0.406: v18.41,16.83 18.41,24.13 13.97,28.57 13.97,31.11 v14.61,31.75 | v131.44,31.11 131.44,36.18 L23.K
  Bottom 0.406: LED2.7 5.71,12.7 10.16,17.14 18.1,17.14 v18.41,16.83 | v14.61,31.75 25.4,31.75 30.48,36.83 64.77,36.83 66.04,35.56 77.47,35.56 83.19,29.84 130.18,29.84 v131.44,31.11
L24  (via drill 0.25)
  Top 0.406: v23.34,17.3 23.34,17.46 22.23,18.57 22.23,32.07 v23.34,33.18 | v66.67,36.83 66.67,37.47 v70.48,41.27 | v148.59,41.27 148.59,36.73 L24.K
  Bottom 0.406: LED2.8 2.54,13.97 5.71,13.97 9.53,17.78 22.86,17.78 v23.34,17.3 | v23.34,33.18 23.81,33.66 26.04,33.66 29.84,37.47 66.04,37.47 v66.67,36.83 | v70.48,41.27 115.57,41.27 116.2,41.91 147.96,41.91 v148.59,41.27
L25  (via drill 0.25)
  Top 0.406: v97.79,11.43 97.79,21.39 L25.K
  Bottom 0.406: LED2.9 5.71,10.16 9.53,13.97 55.24,13.97 57.78,11.43 62.23,11.43 62.87,12.06 97.16,12.06 v97.79,11.43
L26  (via drill 0.25)
  Top 0.406: v114.94,12.06 114.94,21.55 L26.K
  Bottom 0.406: LED2.10 2.54,11.43 5.71,11.43 8.89,14.61 55.88,14.61 58.42,12.06 61.59,12.06 62.23,12.7 114.3,12.7 v114.94,12.06
L27  (via drill 0.25)
  Top 0.406: v28.57,12.06 28.57,14.61 v31.11,17.14
  Bottom 0.406: LED2.11 5.71,7.62 10.79,12.7 27.94,12.7 v28.57,12.06 | v31.11,17.14 31.75,17.78 80.01,17.78 80.64,17.14 113.67,17.14 116.2,19.68 116.2,22.23 118.75,24.77 130.81,24.77 131.44,24.13 131.44,21.97 L27.K
L28  (via drill 0.25)
  Top 0.406: v149.38,10.79 149.7,11.11 149.7,20.31 L28.K
  Bottom 0.406: LED2.12 2.54,8.89 5.71,8.89 10.16,13.34 29.84,13.34 31.75,11.43 51.44,11.43 52.7,12.7 55.24,12.7 57.15,10.79 96.52,10.79 97.16,10.16 148.75,10.16 v149.38,10.79
L29  (via drill 0.25)
  Top 0.406: v17.14,10.16 17.14,24.13 12.7,28.57 v12.7,29.21 | v81.92,28.57 81.92,10.16 v82.55,9.53
  Bottom 0.406: LED2.13 5.71,5.08 10.79,10.16 v17.14,10.16 | v12.7,29.21 14.61,29.21 15.88,30.48 26.67,30.48 31.75,35.56 63.5,35.56 64.77,34.29 76.2,34.29 v81.92,28.57 | v82.55,9.53 95.2,9.53 L29.K
L30  (via drill 0.25)
  Top 0.406: v15.88,11.43 16.51,12.06 16.51,17.14 16.51,23.5 11.43,28.57 11.43,30.48 v10.79,31.11 | v119.38,28.57 v119.38,8.89
  Bottom 0.406: LED2.14 2.54,6.35 5.71,6.35 10.79,11.43 v15.88,11.43 | v10.79,31.11 11.43,30.48 14.61,30.48 15.24,31.11 26.04,31.11 31.11,36.2 64.14,36.2 65.41,34.92 76.83,34.92 82.55,29.21 118.75,29.21 v119.38,28.57 | v119.38,8.89 119.38,8.26 118.11,6.99 115.03,6.99 L30.K
L31  (via drill 0.25)
  Top 0.406: v7.62,3.49 7.62,5.4 7.14,5.87 7.14,24.13 9.84,26.83 9.84,51.44 v10.32,51.59 | v130.33,52.07 130.33,50.01 132.08,48.26 132.08,39.37 130.33,37.62 130.33,34.92 130.65,34.61 130.65,31.75 130.18,31.27 130.18,29.53 130.33,29.37 130.33,20.8 130.81,20.32 130.81,8.15 L31.K
  Bottom 0.406: LED2.15 6.67,2.54 v7.62,3.49 | v10.32,51.59 10.79,51.44 34.13,51.44 35.4,52.7 66.52,52.7 67.15,52.07 80.17,52.07 82.39,54.29 113.98,54.29 115.25,53.02 116.68,53.02 117.16,52.55 129.86,52.55 v130.33,52.07
L32  (via drill 0.25)
  Top 0.406: v6.51,4.45 6.51,24.45 9.21,27.15 9.21,51.75 v10,52.55 | v150.02,55.09 150.34,54.77 150.34,9.52 L32.K
  Bottom 0.406: LED2.16 2.54,3.81 5.87,3.81 v6.51,4.45 | v10,52.55 10.95,52.55 11.43,52.07 33.81,52.07 35.08,53.34 66.83,53.34 67.47,52.7 79.85,52.7 82.07,54.93 114.3,54.93 115.41,53.82 116.84,53.82 117.47,53.18 134.78,53.18 136.84,55.24 149.86,55.24 v150.02,55.09
P1  (via drill 0.25)
  Top 0.406: P1.S 12.22,9.37 v12.7,8.89 | v42.23,7.94 42.23,7.78 42.39,7.62 42.39,2.54 42.55,2.38 42.7,2.25 JP6.10
  Bottom 0.406: v12.7,8.89 17.78,8.89 18.41,9.53 18.41,11.43 19.05,12.06 26.67,12.06 27.94,10.79 31.75,10.79 33.66,8.89 41.27,8.89 v42.23,7.94
P2
  Top 0.406: P2.S 42.94,9.61 46.2,6.35 46.2,3.84 JP6.11
P3  (via drill 0.25)
  Top 0.406: P3.S 73.23,10.05 v72.87,9.68 | v47.47,9.84 47.47,2.51 JP6.12
  Bottom 0.406: v72.87,9.68 72.39,10.16 47.78,10.16 v47.47,9.84
SCL  (via drill 0.25)
  Top 0.406: OLED3.2 52.49,107.1 48.26,102.87 48.26,78.11 53.34,73.03 53.34,11.75 v52.7,11.11 | v34.8,10.16 34.8,2.67 JP6.2
  Bottom 0.406: v52.7,11.11 52.55,11.11 52.23,10.79 35.56,10.79 v34.8,10.16
SDA  (via drill 0.25)
  Top 0.406: v51.44,12.7 52.7,13.97 52.7,72.39 47.41,77.68 OLED2.4 OLED3.1 | v33.66,12.7 33.66,3.94 JP6.1
  Bottom 0.406: v51.44,12.7 50.8,13.34 34.29,13.34 v33.66,12.7
USB1-D+  (via drill 0.25)
  Top 0.406: v36.04,6.99 36.04,3.84 JP6.3
  Bottom 0.406: X1.2 52.5,8.52 50.01,6.03 40.16,6.03 39.21,6.99 v36.04,6.99
USB1-D-  (via drill 0.25)
  Top 0.406: v51.59,5.56 51.59,5.71 v50.01,7.3 | v37.31,7.94 37.31,2.51 JP6.4
  Bottom 0.406: X1.3 58.19,5.32 56.52,3.65 53.5,3.65 v51.59,5.56 | v50.01,7.3 49.37,6.67 40.48,6.67 39.37,7.78 37.47,7.78 v37.31,7.94
USB2-D+  (via drill 0.25)
  Top 0.406: v38.58,6.19 38.58,3.84 JP6.5
  Bottom 0.406: X2.2 22.93,8.03 23.81,7.14 27.46,7.14 28.42,8.1 31.11,8.1 33.34,6.03 38.26,6.03 38.42,6.19 v38.58,6.19
USB2-D-  (via drill 0.25)
  Top 0.406: X2.3 22.93,2.79 v23.18,2.54
  Bottom 0.406: v23.18,2.54 37.02,2.54 JP6.6
X1  (via drill 0.25)
  Top 0.305: 17.78,83.89 U$1.P$2
  Top 0.406: v17.78,102.87 17.78,83.89
  Bottom 0.406: JP10.1 16.51,104.14 v17.78,102.87
X2  (via drill 0.25)
  Top 0.406: v15.88,100.97 15.88,70.88 U$2.P$2
  Bottom 0.305: JP10.3 15.24,101.6 v15.88,100.97
X3  (via drill 0.25)
  Top 0.406: v14.61,99.06 15.24,98.42 15.24,56.6 U$3.P$2
  Bottom 0.305: JP10.5 v14.61,99.06
X4  (via drill 0.25)
  Top 0.305: 78.11,84.15 U$4.P$2
  Top 0.406: v76.83,96.52 78.11,95.25 78.11,84.15
  Bottom 0.406: JP10.7 v76.83,96.52
X5  (via drill 0.25)
  Top 0.406: v76.2,93.98 76.83,93.34 76.83,70.5 U$5.P$2
  Bottom 0.406: JP10.9 v76.2,93.98
X6  (via drill 0.25)
  Top 0.406: v74.93,91.44 75.56,90.81 75.56,56.86 U$6.P$2
  Bottom 0.406: JP10.11 v74.93,91.44
XL1  (via drill 0.25)
  Top 0.406: v7.62,102.87 8.26,102.23 8.26,84.63 U$1.P$1
  Bottom 0.406: JP10.2 2.54,102.87 v7.62,102.87
XL2  (via drill 0.25)
  Top 0.406: v9.53,100.33 9.53,70.99 U$2.P$1
  Bottom 0.406: JP10.4 2.54,100.33 v9.53,100.33
XL3  (via drill 0.25)
  Top 0.406: v10.79,97.79 10.79,57.35 U$3.P$1
  Bottom 0.406: JP10.6 2.54,97.79 v10.79,97.79
XL4  (via drill 0.25)
  Top 0.305: 67.94,83.79 U$4.P$1
  Top 0.406: v67.31,95.25 67.94,94.61 67.94,83.79
  Bottom 0.406: JP10.8 2.54,95.25 v67.31,95.25
XL5  (via drill 0.25)
  Top 0.406: v69.22,92.71 69.85,92.08 69.85,70.73 U$5.P$1
  Bottom 0.406: JP10.10 2.54,92.71 v69.22,92.71
XL6  (via drill 0.25)
  Top 0.406: v71.12,85.72 71.12,57.09 U$6.P$1
  Bottom 0.406: JP10.12 1.27,87.63 2.54,86.36 70.48,86.36 v71.12,85.72